# Altium project CAMERON.PrjPcb
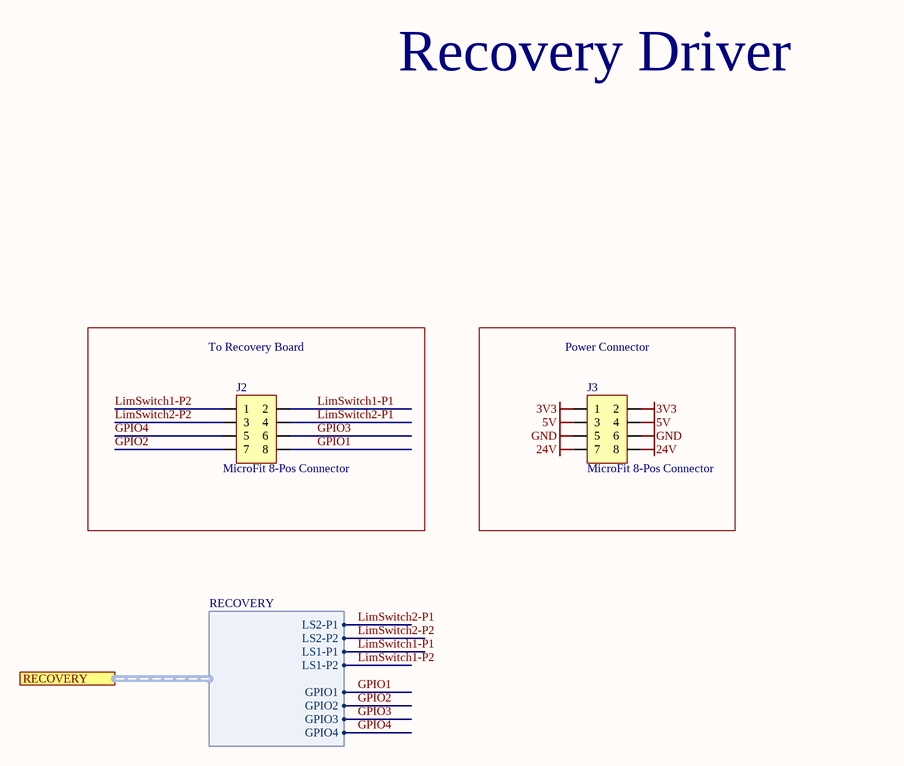
[diagram p0: Recovery.SchDoc]
13 sheets, 125 parts. Net scope: hierarchical (ports join the sheet entries above them; power ports are global).
Board file: CAMERON.PcbDoc
Sheets:
  Recovery.SchDoc
  CAMERON.SchDoc
    RIO_MCU = RIO_MCU.SchDoc
    Debugging/Programming = SWD_Breakout.SchDoc
    Power = Power.SchDoc
    Thermocouples = Thermocouples.SchDoc
      Thermocouple_Amplifier1 = Thermocouple_Amplifier.SchDoc
      Thermocouple_Amplifier2 = Thermocouple_Amplifier.SchDoc
      Thermocouple_Amplifier3 = Thermocouple_Amplifier.SchDoc
      Thermocouple_Amplifier4 = Thermocouple_Amplifier.SchDoc
    Solenoids = Solenoids.SchDoc
      Solenoid Driver1 = Solenoid_Driver.SchDoc
      Solenoid Driver2 = Solenoid_Driver.SchDoc
      Solenoid Driver3 = Solenoid_Driver.SchDoc
      Solenoid Driver4 = Solenoid_Driver.SchDoc
      Solenoid Driver5 = Solenoid_Driver.SchDoc
    Pressure Transducers = Pressure_Transducers.SchDoc
    Flight Computer = Flight_Computer.SchDoc
    XBee Radio = XBee.SchDoc
    Power_Monitor = Power_Monitor.SchDoc

## Sheet Recovery.SchDoc
size Letter; Organization: Altium Limited; Address1: L3, 12a Rodborough Rd; Address2: Frenchs Forest; Address3: NSW; Address4: Australia 2086

### Parts
(Parts that share a designator on the sheet are numbered #1, #2 ... from top to bottom, then left to right.)
J2#1  MicroFit 8-Pos Connector  [Microfit-8Pos]
J3#1  MicroFit 8-Pos Connector  [Microfit-8Pos]

### Blocks framed on the sheet
To Recovery Board: J2#1
Power Connector: J3#1

### Ports
RECOVERY (harness RECOVERY)

### Harnesses
RECOVERY: LS2-P1, LS2-P2, LS1-P1, LS1-P2, GPIO1, GPIO2, GPIO3, GPIO4

### Nets
3V3: J3#1.1 J3#1.2
5V: J3#1.3 J3#1.4
24V: J3#1.7 J3#1.8
GND: J3#1.5 J3#1.6
GPIO1: J2#1.8 ; port RECOVERY.GPIO1
GPIO2: J2#1.7 ; port RECOVERY.GPIO2
GPIO3: J2#1.6 ; port RECOVERY.GPIO3
GPIO4: J2#1.5 ; port RECOVERY.GPIO4
LimSwitch1-P1: J2#1.2 ; port RECOVERY.LS1-P1
LimSwitch1-P2: J2#1.1 ; port RECOVERY.LS1-P2
LimSwitch2-P1: J2#1.4 ; port RECOVERY.LS2-P1
LimSwitch2-P2: J2#1.3 ; port RECOVERY.LS2-P2

### Notes on the sheet
- Recovery Driver
- Title
- Size:
- Date:
- Letter
- Number:
- Time:
- Revision:
- Sheet
- of
- File:

### Library data of the parts
J2#1 J3#1 = Micro-Fit 8Pos: Molex MicroFit 8-Pos Connector; URL: https://www.digikey.com/products/en?WT.z_cid=sp_900_0310_buynow&keywords=430450813; DigiKey PN: WM2651-ND

## Sheet CAMERON.SchDoc
size Letter; Organization: Altium Limited; Address1: L3, 12a Rodborough Rd; Address2: Frenchs Forest; Address3: NSW; Address4: Australia 2086
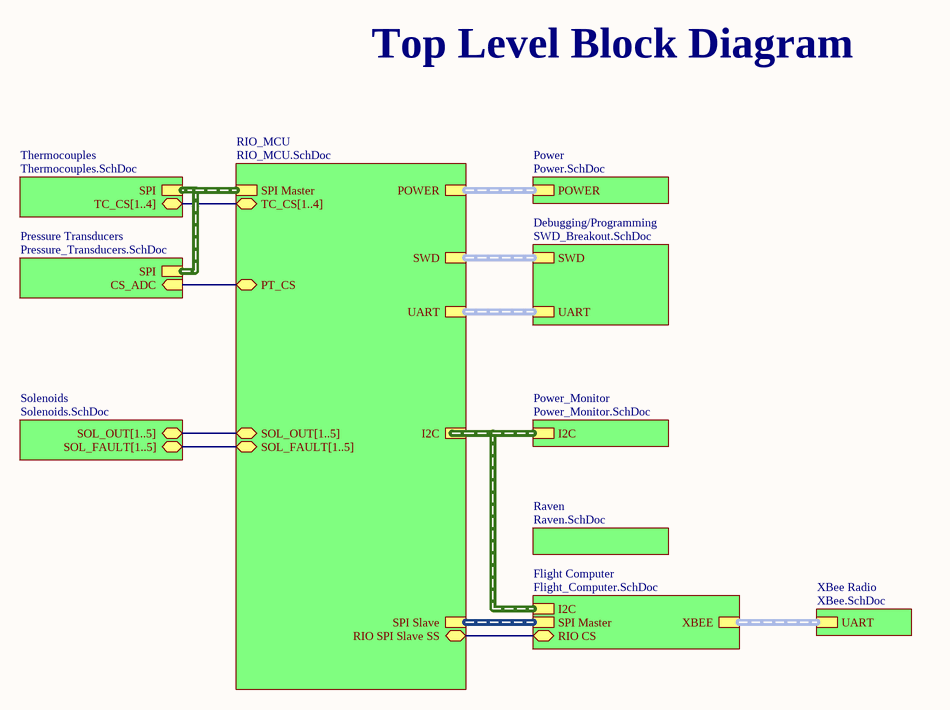
[diagram p1: CAMERON.SchDoc]

### Sub-sheets
Debugging/Programming = SWD_Breakout.SchDoc: SWD (harness SWD), UART (harness UART)
Flight Computer = Flight_Computer.SchDoc: SPI Master (harness SPI), RIO CS (bidir), XBEE (harness UART), I2C (harness I2C)
Power = Power.SchDoc: POWER (harness POWER)
Power_Monitor = Power_Monitor.SchDoc: I2C (harness I2C)
Pressure Transducers = Pressure_Transducers.SchDoc: SPI (harness SPI), CS_ADC (in)
Raven = Raven.SchDoc (file not in this document): no entries
RIO_MCU = RIO_MCU.SchDoc: I2C (harness I2C), SPI Master (harness SPI), SWD (harness SWD), POWER (harness POWER), TC_CS[1..4] (bidir), SPI Slave (harness SPI), RIO SPI Slave SS (bidir), SOL_OUT[1..5] (bidir), SOL_FAULT[1..5] (bidir), PT_CS (bidir), UART (harness UART)
Solenoids = Solenoids.SchDoc: SOL_OUT[1..5] (bidir), SOL_FAULT[1..5] (bidir)
Thermocouples = Thermocouples.SchDoc: SPI (harness SPI), TC_CS[1..4] (bidir)
XBee Radio = XBee.SchDoc: UART (harness UART)

### Nets
PT_CS: sheet RIO_MCU/PT_CS, sheet Pressure Transducers/CS_ADC
NetU1_77: sheet RIO_MCU/RIO SPI Slave SS, sheet Flight Computer/RIO CS

### Buses and harness runs
bus sheet RIO_MCU/SOL_FAULT[1..5] = sheet Solenoids/SOL_FAULT[1..5]
bus sheet RIO_MCU/SOL_OUT[1..5] = sheet Solenoids/SOL_OUT[1..5]
bus sheet RIO_MCU/TC_CS[1..4] = sheet Thermocouples/TC_CS[1..4]
harness sheet Debugging/Programming/SWD = sheet RIO_MCU/SWD
harness sheet Debugging/Programming/UART = sheet RIO_MCU/UART
harness sheet Flight Computer/I2C = sheet Power_Monitor/I2C = sheet RIO_MCU/I2C
harness sheet Flight Computer/SPI Master = sheet RIO_MCU/SPI Slave
harness sheet Flight Computer/XBEE = sheet XBee Radio/UART
harness sheet Power/POWER = sheet RIO_MCU/POWER
harness sheet Pressure Transducers/SPI = sheet RIO_MCU/SPI Master = sheet Thermocouples/SPI

### Notes on the sheet
- Top Level Block Diagram
- Title
- Size:
- Date:
- Letter
- Number:
- Time:
- Revision:
- Sheet
- of
- File:

## Sheet RIO_MCU.SchDoc
size Letter; Organization: Altium Limited; Address1: L3, 12a Rodborough Rd; Address2: Frenchs Forest; Address3: NSW; Address4: Australia 2086
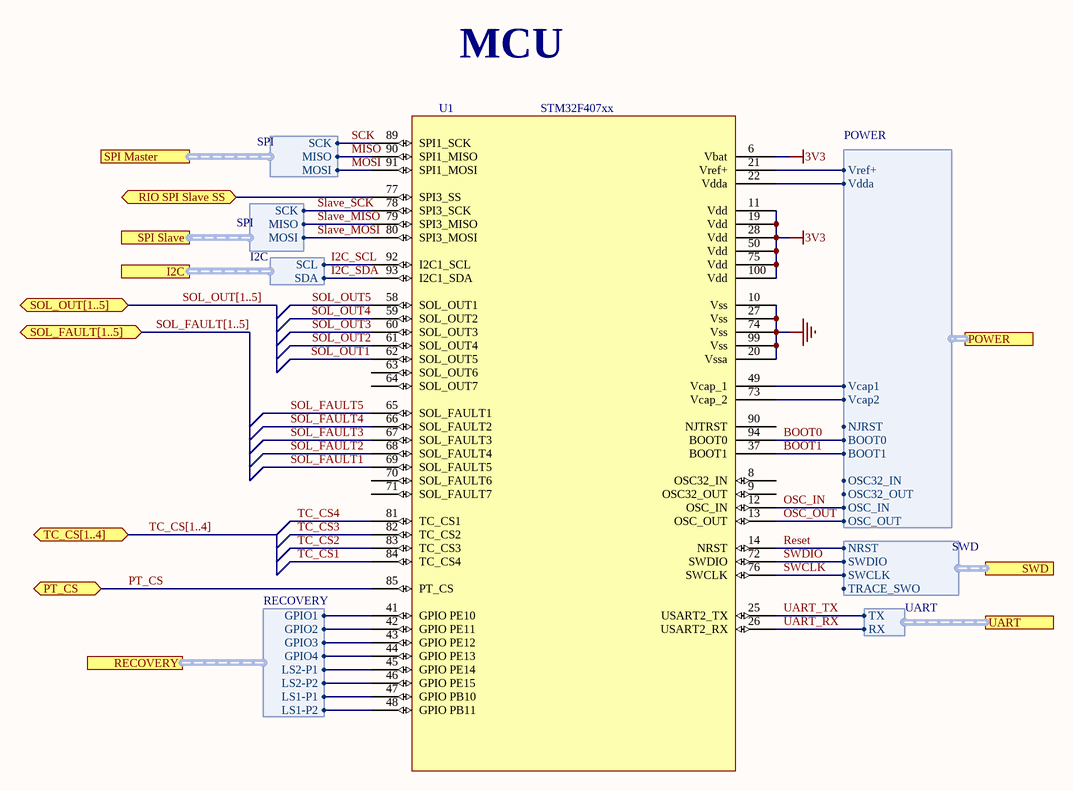
[diagram p2: RIO_MCU.SchDoc]

### Parts
U1  STM32F407xx  [LQFP100]

### Ports
I2C (harness I2C), POWER (harness POWER), PT_CS (bidir), RECOVERY (harness RECOVERY), RIO SPI Slave SS (bidir), SOL_FAULT[1..5] (bidir), SOL_OUT[1..5] (bidir), SPI Master (harness SPI), SPI Slave (harness SPI), SWD (harness SWD), TC_CS[1..4] (bidir), UART (harness UART)

### Harnesses
I2C: SCL, SDA
SWD: NRST, SWDIO, SWCLK, TRACE_SWO
POWER: Vdda, Vref+, Vcap1, Vcap2, NJRST, BOOT0, BOOT1, OSC32_IN, OSC32_OUT, OSC_IN, OSC_OUT
SPI: SCK, MISO, MOSI
SPI: MISO, MOSI, SCK
UART: RX, TX
RECOVERY: GPIO1, GPIO2, GPIO3, GPIO4, LS1-P1, LS1-P2, LS2-P1, LS2-P2

### Nets
3V3: U1.6(Vbat) U1.11(Vdd) U1.19(Vdd) U1.28(Vdd) U1.50(Vdd) U1.75(Vdd) U1.100(Vdd)
GND: U1.10(Vss) U1.20(Vssa) U1.27(Vss) U1.74(Vss) U1.99(Vss)
BOOT0: U1.94(BOOT0) ; port POWER.BOOT0
BOOT1: U1.37(BOOT1) ; port POWER.BOOT1
I2C_SCL: U1.92(I2C1_SCL) ; port I2C.SCL
I2C_SDA: U1.93(I2C1_SDA) ; port I2C.SDA
MISO: U1.90(NJTRST) ; port SPI Master.MISO
MOSI: U1.91(SPI1_MOSI) ; port SPI Master.MOSI
OSC_IN: U1.12(OSC_IN) ; port POWER.OSC_IN
OSC_OUT: U1.13(OSC_OUT) ; port POWER.OSC_OUT
PT_CS: U1.85(PT_CS) ; port PT_CS
Reset: U1.14(NRST) ; port SWD.NRST
SCK: U1.89(SPI1_SCK) ; port SPI Master.SCK
Slave_MISO: U1.79(SPI3_MISO) ; port SPI Slave.MISO
Slave_MOSI: U1.80(SPI3_MOSI) ; port SPI Slave.MOSI
Slave_SCK: U1.78(SPI3_SCK) ; port SPI Slave.SCK
SOL_FAULT1: U1.69(SOL_FAULT5)  [project net FAULT]
SOL_FAULT2: U1.68(SOL_FAULT4)  [project net FAULT]
SOL_FAULT3: U1.67(SOL_FAULT3)  [project net FAULT]
SOL_FAULT4: U1.66(SOL_FAULT2)  [project net FAULT]
SOL_FAULT5: U1.65(SOL_FAULT1)  [project net FAULT]
SOL_OUT1: U1.62(SOL_OUT5)  [project net SOL]
SOL_OUT2: U1.61(SOL_OUT4)  [project net SOL]
SOL_OUT3: U1.60(SOL_OUT3)  [project net SOL]
SOL_OUT4: U1.59(SOL_OUT2)  [project net SOL]
SOL_OUT5: U1.58(SOL_OUT1)  [project net SOL]
SWCLK: U1.76(SWCLK) ; port SWD.SWCLK
SWDIO: U1.72(SWDIO) ; port SWD.SWDIO
TC_CS1: U1.84(TC_CS4)  [project net CS]
TC_CS2: U1.83(TC_CS3)  [project net CS]
TC_CS3: U1.82(TC_CS2)  [project net CS]
TC_CS4: U1.81(TC_CS1)  [project net CS]
UART_RX: U1.26(USART2_RX) ; port UART.RX
UART_TX: U1.25(USART2_TX) ; port UART.TX
NetC10_2: U1.49(Vcap_1) ; port POWER.Vcap1
NetC11_2: U1.73(Vcap_2) ; port POWER.Vcap2
NetC12_2: U1.22(Vdda) ; port POWER.Vdda
NetC14_1: U1.21(Vref+) ; port POWER.Vref+
NetU1_41: U1.41(GPIO_PE10) ; port RECOVERY.GPIO1
NetU1_42: U1.42(GPIO_PE11) ; port RECOVERY.GPIO2
NetU1_43: U1.43(GPIO_PE12) ; port RECOVERY.GPIO3
NetU1_44: U1.44(GPIO_PE13) ; port RECOVERY.GPIO4
NetU1_45: U1.45(GPIO_PE14) ; port RECOVERY.LS2-P1
NetU1_46: U1.46(GPIO_PE15) ; port RECOVERY.LS2-P2
NetU1_47: U1.47(GPIO_PB10) ; port RECOVERY.LS1-P1
NetU1_48: U1.48(GPIO_PB11) ; port RECOVERY.LS1-P2
NetU1_77: U1.77(SPI3_SS) ; port RIO SPI Slave SS

Not connected (* = marked no-connect by the designer): U1 8(OSC32_IN) 9(OSC32_OUT) 63(SOL_OUT6) 64(SOL_OUT7) 70(SOL_FAULT6) 71(SOL_FAULT7)

### Buses and harness runs
bus SOL_FAULT[1..5] = port SOL_FAULT[1..5]
bus SOL_OUT[1..5] = port SOL_OUT[1..5]
bus TC_CS[1..4] = port TC_CS[1..4]

### Notes on the sheet
- MCU
- Title
- Size:
- Date:
- Letter
- Number:
- Time:
- Revision:
- Sheet
- of
- File:

## Sheet SWD_Breakout.SchDoc
size Letter; Organization: Altium Limited; Address1: L3, 12a Rodborough Rd; Address2: Frenchs Forest; Address3: NSW; Address4: Australia 2086
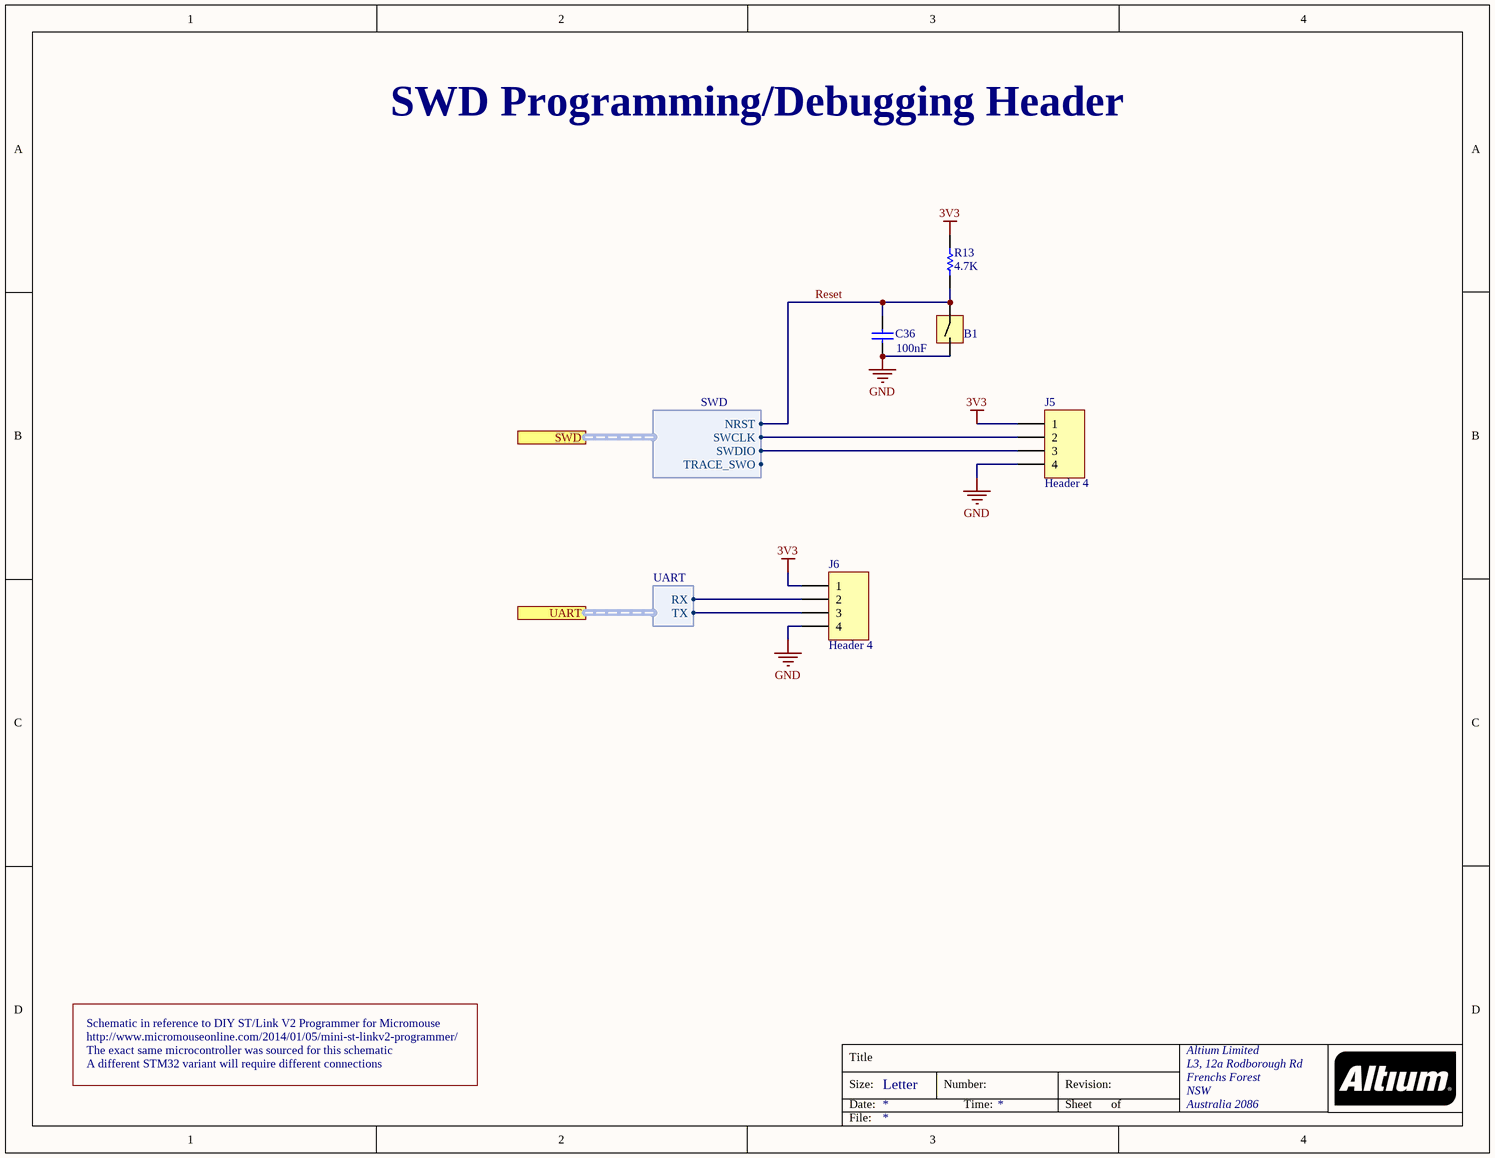
[diagram p3: SWD_Breakout.SchDoc]

### Parts
B1  Push Button  [PUSHBUTTON]  (value not drawn)
C36  value 100nF  [CAP_0603]  (hidden comment: Cap)
J5  Header 4  [HDR1X4]
J6  Header 4  [HDR1X4]
R13  value 4.7K  [RES_0603]  (hidden comment: Res1)

### Ports
SWD (harness SWD), UART (harness UART)

### Harnesses
SWD: NRST, SWCLK, SWDIO, TRACE_SWO
UART: RX, TX

### Nets
3V3: J5.1 J6.1 R13.2
GND: B1.2 C36.1 J5.4 J6.4
Reset: B1.1 C36.2 R13.1 ; port SWD.NRST
SWCLK: J5.2 ; port SWD.SWCLK
SWDIO: J5.3 ; port SWD.SWDIO
UART_RX: J6.2 ; port UART.RX
UART_TX: J6.3 ; port UART.TX

### Notes on the sheet
- SWD Programming/Debugging Header
- http://www.micromouseonline.com/2014/01/05/mini-st-linkv2-programmer/
- Schematic in reference to DIY ST/Link V2 Programmer for Micromouse
- The exact same microcontroller was sourced for this schematic
- A different STM32 variant will require different connections
- Title
- Size:
- Date:
- Letter
- Number:
- Time:
- Revision:
- Sheet
- of
- File:

### Library data of the parts
B1 = PushButton
C36 = Cap: Capacitor
J5 J6 = Header 4: Header, 4-Pin; LatestRevisionDate: 17-Jul-2002; LatestRevisionNote: Re-released for DXP Platform.; Publisher: Altium Limited
R13 = Res1: Resistor

## Sheet Power.SchDoc
size Letter; Organization: Altium Limited; Address1: L3, 12a Rodborough Rd; Address2: Frenchs Forest; Address3: NSW; Address4: Australia 2086
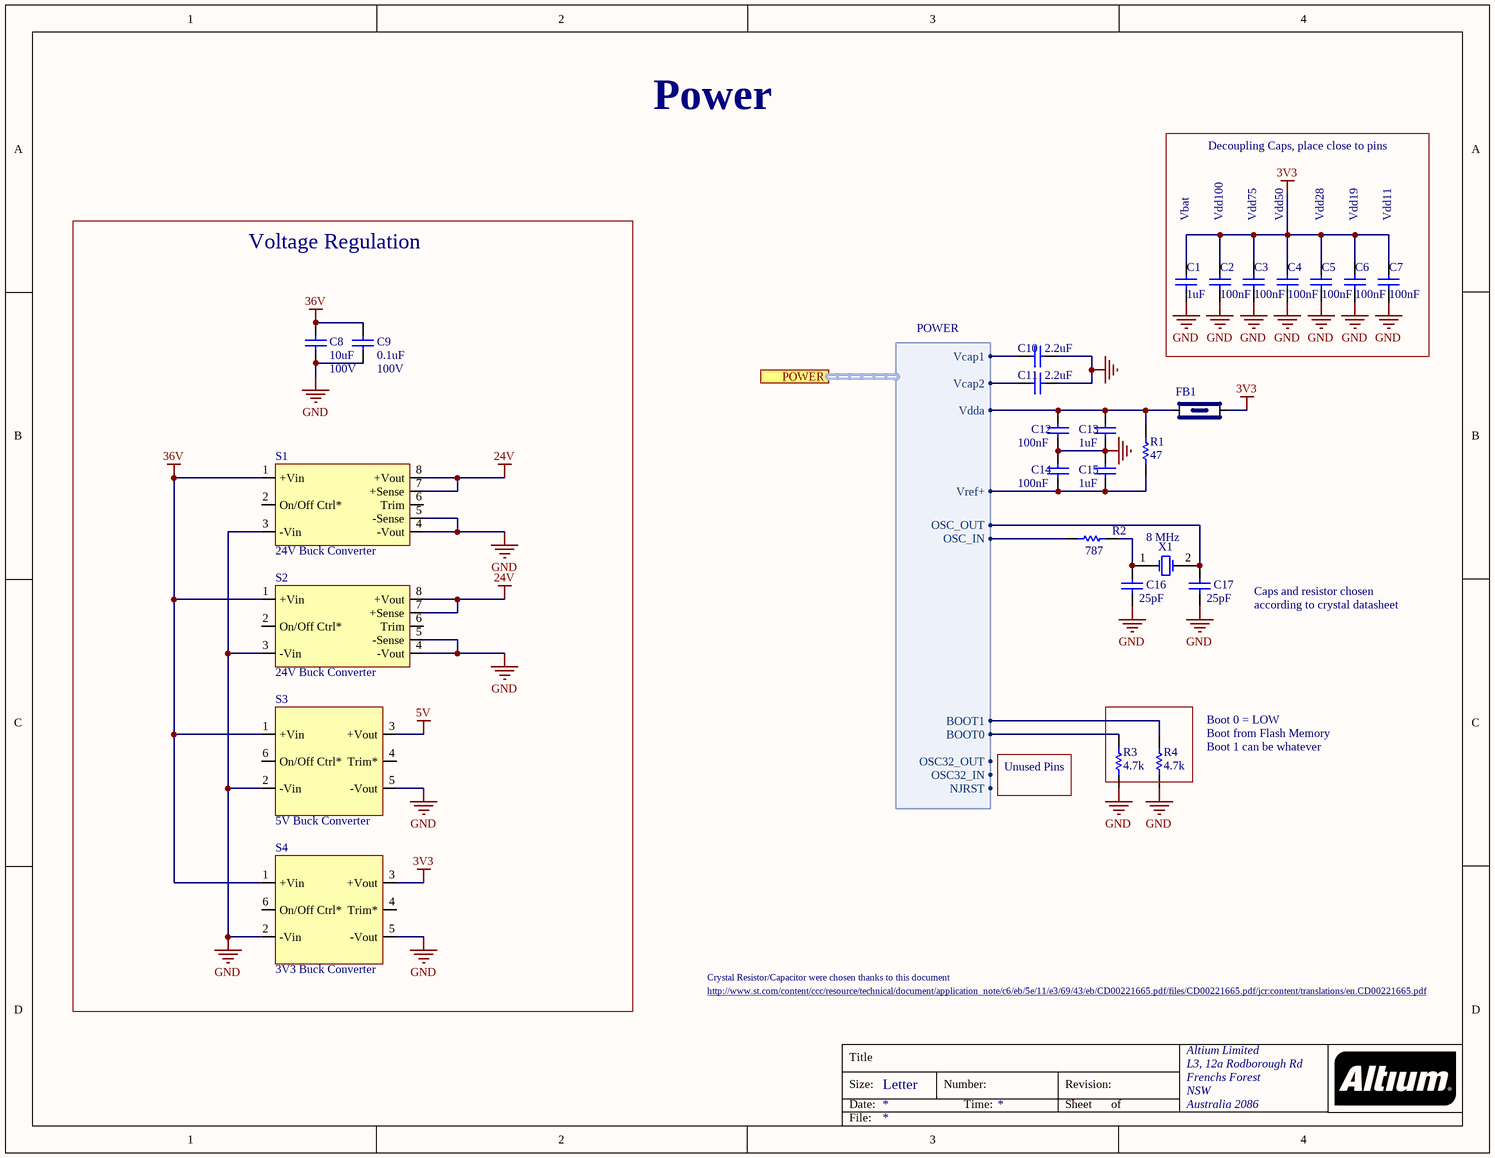
[diagram p4: Power.SchDoc]

### Parts
(Parts that share a designator on the sheet are numbered #1, #2 ... from top to bottom, then left to right.)
C1  value 1uF  [CAP_0603]
C2  value 100nF  [CAP_0603]
C3  value 100nF  [CAP_0603]
C4  value 100nF  [CAP_0603]
C5  value 100nF  [CAP_0603]
C6  value 100nF  [CAP_0603]
C7  value 100nF  [CAP_0603]
C8  value 10uF  Voltage: 100V  [2220]  (hidden comment: Cap)
C9  value 0.1uF  Voltage: 100V  [CAP_0603]  (hidden comment: Cap)
C10  value 2.2uF  [CAP_0603]
C11  value 2.2uF  [CAP_0603]
C12  value 100nF  [CAP_0603]
C13  value 1uF  [CAP_0603]
C14  value 100nF  [CAP_0603]
C15  value 1uF  [CAP_0603]
C16  value 25pF  [CAP_0603]
C17  value 25pF  [CAP_0603]
FB1  Ferrite Bead  [0603]  (value not drawn)
R1  value 47  [RES_0603]  (hidden comment: Res1)
R2#1  value 787  [RES_0603]  (hidden comment: Res1)
R3#1  value 4.7k  [RES_0603]  (hidden comment: Res1)
R4#1  value 4.7k  [RES_0603]  (hidden comment: Res1)
S1  24V Buck Converter  [UWE-24/3-Q12]
S2  24V Buck Converter  [UWE-24/3-Q12]
S3  5V Buck Converter  [SPM15-050-Q12P-C]
S4  3V3 Buck Converter  [SPM15-033-Q48N-C]
X1  Frequency: 8 MHz  [OSC_8MHz]  (hidden comment: XTAL)

### Blocks framed on the sheet
Voltage Regulation: C8 C9 S1-S4

### Ports
POWER (harness POWER)

### Harnesses
POWER: BOOT0, BOOT1, NJRST, OSC_IN, OSC_OUT, OSC32_IN, OSC32_OUT, Vcap1, Vcap2, Vdda, Vref+

### Nets
3V3: C1.2 C2.2 C3.2 C4.2 C5.2 C6.2 C7.2 FB1.2 S4.3(+Vout)
5V: S3.3(+Vout)
24V: S1.7(+Sense) S1.8(+Vout) S2.7(+Sense) S2.8(+Vout)
36V: C8.2 C9.2 S1.1(+Vin) S2.1(+Vin) S3.1(+Vin) S4.1(+Vin)
GND: C1.1 C2.1 C3.1 C4.1 C5.1 C6.1 C7.1 C8.1 C9.1 C10.1 C11.1 C12.1 C13.1 C14.2 C15.2 C16.1 C17.1 R3#1.1 R4#1.1 S1.3(-Vin) S1.4(-Vout) S1.5(-Sense) S2.3(-Vin) S2.4(-Vout) S2.5(-Sense) S3.2(-Vin) S3.5(-Vout) S4.2(-Vin) S4.5(-Vout)
BOOT0: R3#1.2 ; port POWER.BOOT0
BOOT1: R4#1.2 ; port POWER.BOOT1
OSC_IN: R2#1.2 ; port POWER.OSC_IN
OSC_OUT: C17.2 X1.2(OSC2) ; port POWER.OSC_OUT
NetC10_2: C10.2 ; port POWER.Vcap1
NetC11_2: C11.2 ; port POWER.Vcap2
NetC12_2: C12.2 C13.2 FB1.1 R1.2 ; port POWER.Vdda
NetC14_1: C14.1 C15.1 R1.1 ; port POWER.Vref+
NetC16_2: C16.2 R2#1.1 X1.1(OSC1)

Not connected (* = marked no-connect by the designer): S1 2(On/Off_Ctrl*) 6(Trim); S2 2(On/Off_Ctrl*) 6(Trim); S3 4(Trim*) 6(On/Off_Ctrl*); S4 4(Trim*) 6(On/Off_Ctrl*)

### Notes on the sheet
- Power
- Decoupling Caps, place close to pins
- Vbat
- Vdd100
- Vdd75
- Vdd50
- Vdd28
- Vdd19
- Vdd11
- Caps and resistor chosen
- according to crystal datasheet
- (near R3#1) Unused Pins
- (near R4#1) Boot 0 = LOW
- (near R4#1) Boot from Flash Memory
- (near R4#1) Boot 1 can be whatever
- http://www.st.com/content/ccc/resource/technical/document/application_note/c6/eb/5e/11/e3/69/43/eb/CD00221665.pdf/files/CD00221665.pdf/jcr:content/translations/en.CD00221665.pdf
- Crystal Resistor/Capacitor were chosen thanks to this document
- Title
- Size:
- Date:
- Letter
- Number:
- Time:
- Revision:
- Sheet
- of
- File:

### Library data of the parts
C1-C17 = Cap: Capacitor
  C8 C9: Published: 8-Jun-2000; LatestRevisionDate: 17-Jul-2002; LatestRevisionNote: Re-released for DXP Platform.; PackageReference: RAD-0.3; Publisher: Altium Limited; PackageDescription: Radial Cap, Thru-Hole; 2 Leads; 0.3 in Pin Spacing
R1 R2#1 R3#1 R4#1 = Res1: Resistor
S1 S2 = UWE-24/3-Q12PB-C: CONV DC/DC 72W 24V 3A; Link: https://www.digikey.com/product-detail/en/murata-power-solutions-inc/UWE-24-3-Q12PB-C/811-2236-5-ND/2346086
S3 = SPM15-050-Q12P-C: DC/DC CONVERTER 5V 15W; Link: https://www.digikey.com/product-detail/en/murata-power-solutions-inc/SPM15-050-Q12P-C/811-2909-5-ND/4693860
S4 = SPM15-033-Q12P-C: DC/DC CONVERTER 3.3V 15W; Link: https://www.digikey.com/product-detail/en/murata-power-solutions-inc/SPM15-033-Q12P-C/811-2907-5-ND/4693858
X1 = XTAL: Crystal Oscillator

## Sheet Thermocouples.SchDoc
size Letter; Organization: Altium Limited; Address1: L3, 12a Rodborough Rd; Address2: Frenchs Forest; Address3: NSW; Address4: Australia 2086
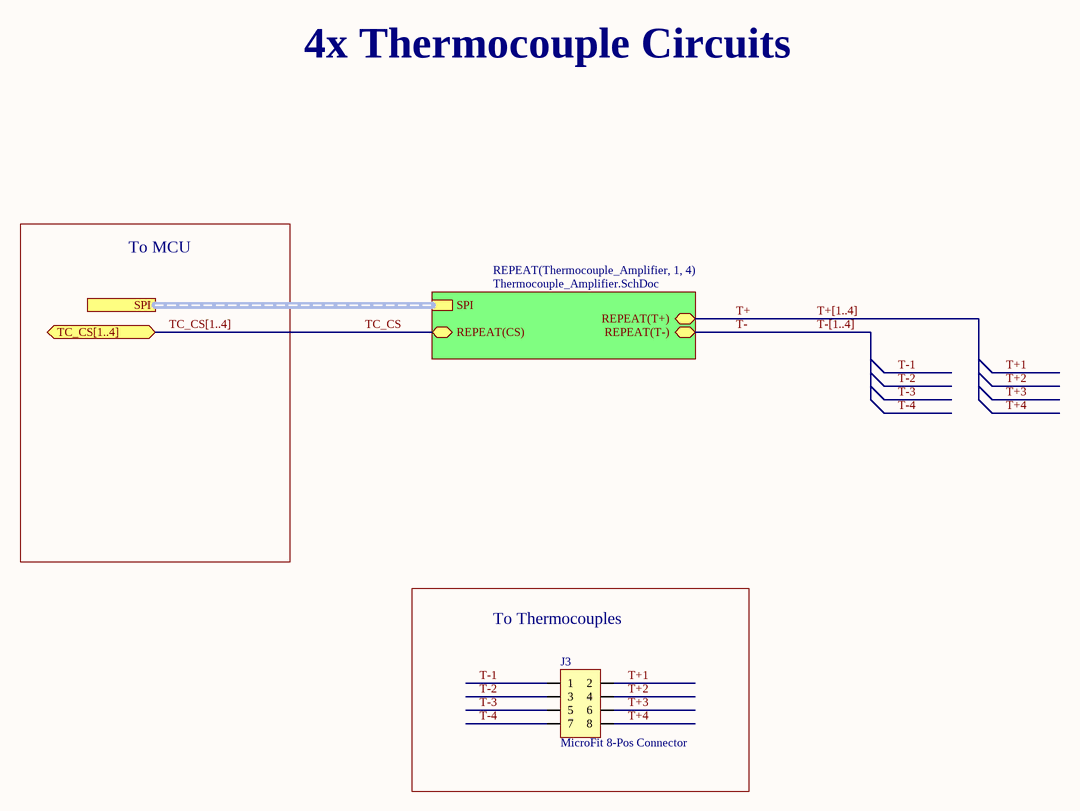
[diagram p5: Thermocouples.SchDoc]

### Parts
(Parts that share a designator on the sheet are numbered #1, #2 ... from top to bottom, then left to right.)
J3#2  MicroFit 8-Pos Connector  [Microfit-8Pos]

### Blocks framed on the sheet
To Thermocouples: J3#2

### Sub-sheets
REPEAT(Thermocouple_Amplifier, 1, 4) = Thermocouple_Amplifier.SchDoc: SPI (harness SPI), REPEAT(CS) (bidir), REPEAT(T+) (bidir), REPEAT(T-) (bidir)

### Ports
SPI (harness SPI), TC_CS[1..4] (bidir)

### Nets
T+: sheet REPEAT(Thermocouple_Amplifier, 1, 4)/REPEAT(T+)
T+1: J3#2.2  [project net T+]
T+2: J3#2.4  [project net T+]
T+3: J3#2.6  [project net T+]
T+4: J3#2.8  [project net T+]
T-: sheet REPEAT(Thermocouple_Amplifier, 1, 4)/REPEAT(T-)
T-1: J3#2.1  [project net T-]
T-2: J3#2.3  [project net T-]
T-3: J3#2.5  [project net T-]
T-4: J3#2.7  [project net T-]
TC_CS: sheet REPEAT(Thermocouple_Amplifier, 1, 4)/REPEAT(CS)

### Buses and harness runs
bus T+[1..4]
bus T-[1..4]
bus TC_CS[1..4] = port TC_CS[1..4]
harness port SPI = sheet REPEAT(Thermocouple_Amplifier, 1, 4)/SPI

### Notes on the sheet
- 4x Thermocouple Circuits
- To MCU
- Title
- Size:
- Date:
- Letter
- Number:
- Time:
- Revision:
- Sheet
- of
- File:

### Library data of the parts
J3#2 = Micro-Fit 8Pos: Molex MicroFit 8-Pos Connector; URL: https://www.digikey.com/products/en?WT.z_cid=sp_900_0310_buynow&keywords=430450813; DigiKey PN: WM2651-ND

## Sheet Thermocouple_Amplifier.SchDoc
size Letter; Organization: Altium Limited; Address1: L3, 12a Rodborough Rd; Address2: Frenchs Forest; Address3: NSW; Address4: Australia 2086
Used 4 times, as channels Thermocouples/Thermocouple_Amplifier1, Thermocouples/Thermocouple_Amplifier2, Thermocouples/Thermocouple_Amplifier3, Thermocouples/Thermocouple_Amplifier4. Parts and nets are listed once, with the designators drawn on the sheet.
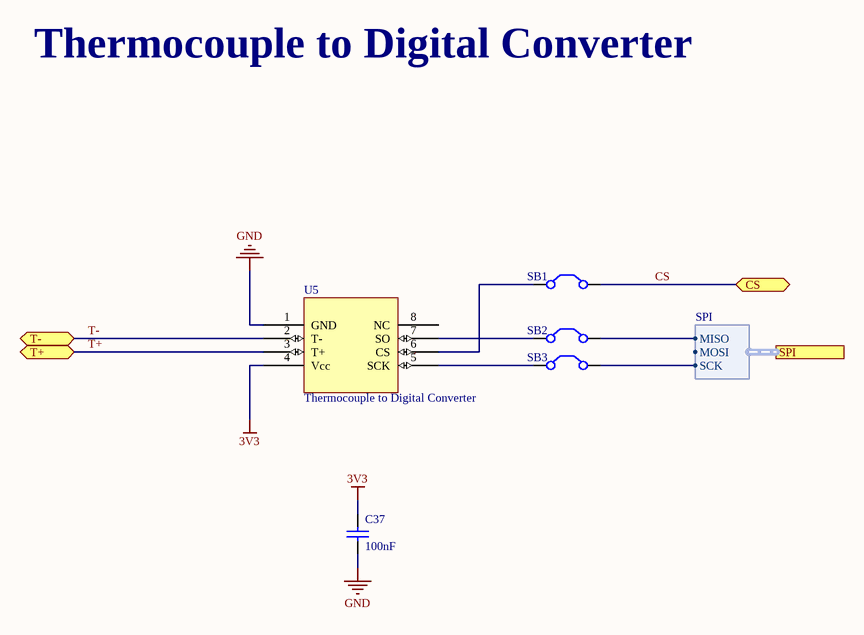
[diagram p6: Thermocouple_Amplifier.SchDoc]

### Parts
C37  value 100nF  [0603]  (hidden comment: Cap)
SB1  Solder Bridge  [Solder Bridge]  (value not drawn)
SB2  Solder Bridge  [Solder Bridge]  (value not drawn)
SB3  Solder Bridge  [Solder Bridge]  (value not drawn)
U5  Thermocouple to Digital Converter  [8-SOIC MAXIM]

### Ports
CS (bidir), SPI (harness SPI), T+ (bidir), T- (bidir)

### Harnesses
SPI: MISO, MOSI, SCK

### Nets
3V3: C37.2 U5.4(Vcc)
GND: C37.1 U5.1(GND)
CS: SB1.2(C2) ; port CS
T+: U5.3(T+) ; port T+
T-: U5.2(T-) ; port T-
NetSB1_1: SB1.1(C1) U5.6(CS)
NetSB2_1: SB2.1(C1) U5.7(SO)
NetSB2_2: SB2.2(C2) ; port SPI.MISO
NetSB3_1: SB3.1(C1) U5.5(SCK)
NetSB3_2: SB3.2(C2) ; port SPI.SCK

Not connected (* = marked no-connect by the designer): U5 8(NC)

### Channels
Thermocouples/Thermocouple_Amplifier1: designators end in _Thermocouple_Amplifier1; ports CS=CS T+=T+ T-=T-
Thermocouples/Thermocouple_Amplifier2: designators end in _Thermocouple_Amplifier2; ports CS=CS T+=T+ T-=T-
Thermocouples/Thermocouple_Amplifier3: designators end in _Thermocouple_Amplifier3; ports CS=CS T+=T+ T-=T-
Thermocouples/Thermocouple_Amplifier4: designators end in _Thermocouple_Amplifier4; ports CS=CS T+=T+ T-=T-

### Notes on the sheet
- Thermocouple to Digital Converter
- Title
- Size:
- Date:
- Letter
- Number:
- Time:
- Revision:
- Sheet
- of
- File:

### Library data of the parts
C37 = Cap: Capacitor
SB1-SB3 = Jumper: Jumper Wire
U5 = MAX31855x: Manufacturer PN: MAX31855EASA+; Thermocouple Type: E; DigiKey PN: MAX31855EASA+-ND

## Sheet Solenoids.SchDoc
size Letter; Organization: Altium Limited; Address1: L3, 12a Rodborough Rd; Address2: Frenchs Forest; Address3: NSW; Address4: Australia 2086
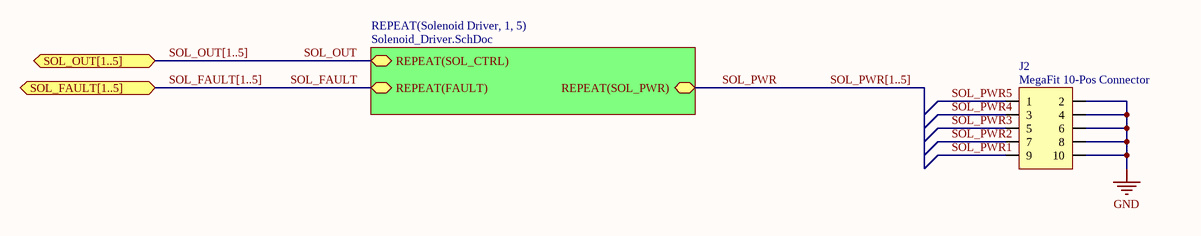
[diagram p7: Solenoids.SchDoc]

### Parts
(Parts that share a designator on the sheet are numbered #1, #2 ... from top to bottom, then left to right.)
J2#2  MegaFit 10-Pos Connector  [MegaFit-10Pos]

### Sub-sheets
REPEAT(Solenoid Driver, 1, 5) = Solenoid_Driver.SchDoc: REPEAT(FAULT) (bidir), REPEAT(SOL_CTRL) (bidir), REPEAT(SOL_PWR) (bidir)

### Ports
SOL_FAULT[1..5] (bidir), SOL_OUT[1..5] (bidir)

### Nets
GND: J2#2.2 J2#2.4 J2#2.6 J2#2.8 J2#2.10
SOL_FAULT: sheet REPEAT(Solenoid Driver, 1, 5)/REPEAT(FAULT)
SOL_OUT: sheet REPEAT(Solenoid Driver, 1, 5)/REPEAT(SOL_CTRL)
SOL_PWR: sheet REPEAT(Solenoid Driver, 1, 5)/REPEAT(SOL_PWR)
SOL_PWR1: J2#2.9
SOL_PWR2: J2#2.7
SOL_PWR3: J2#2.5
SOL_PWR4: J2#2.3
SOL_PWR5: J2#2.1

### Buses and harness runs
bus SOL_FAULT[1..5] = port SOL_FAULT[1..5]
bus SOL_OUT[1..5] = port SOL_OUT[1..5]
bus SOL_PWR[1..5]

### Notes on the sheet
- Title
- Size:
- Date:
- Letter
- Number:
- Time:
- Revision:
- Sheet
- of
- File:

### Library data of the parts
J2#2 = Mega-Fit 10Pos: Molex MegaFit 10-Pos Connector; URL: https://www.digikey.com/product-detail/en/molex-llc/0768290010/WM11979-ND/5639621; DigiKey PN: WM11979-ND

## Sheet Solenoid_Driver.SchDoc
size Letter; Organization: Altium Limited; Address1: L3, 12a Rodborough Rd; Address2: Frenchs Forest; Address3: NSW; Address4: Australia 2086
Used 5 times, as channels Solenoids/Solenoid Driver1, Solenoids/Solenoid Driver2, Solenoids/Solenoid Driver3, Solenoids/Solenoid Driver4, Solenoids/Solenoid Driver5. Parts and nets are listed once, with the designators drawn on the sheet.
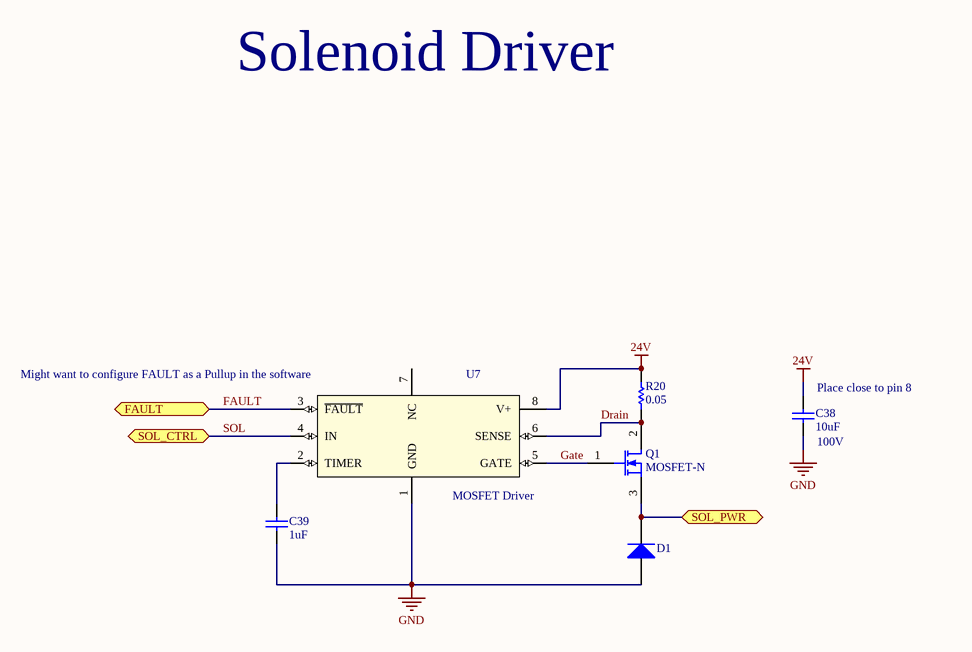
[diagram p8: Solenoid_Driver.SchDoc]

### Parts
C38  value 10uF  Voltage: 100V  [1206]  (hidden comment: Cap)
C39  value 1uF  [0603]  (hidden comment: Cap)
D1  Diode  [SMC]  (value not drawn)
Q1  MOSFET-N  [DPAK2]
R20  value 0.05  [0603]  (hidden comment: Res1)
U7  MOSFET Driver  [PSO-8]

### Ports
FAULT (bidir), SOL_CTRL (bidir), SOL_PWR (bidir)

### Nets
24V: C38.2 R20.2 U7.8(V+)
GND: C38.1 C39.1 D1.1(A) U7.1(GND)
Drain: Q1.2(D) R20.1 U7.6(SENSE)
FAULT: U7.3(~{FAULT}) ; port FAULT
Gate: Q1.1(G) U7.5(GATE)
SOL: U7.4(IN) ; port SOL_CTRL
SOL_PWR: D1.2(K) Q1.3(S) ; port SOL_PWR
NetC39_2: C39.2 U7.2(TIMER)

Not connected (* = marked no-connect by the designer): U7 7(NC)

### Channels
Solenoids/Solenoid Driver1: designators end in _SolenoidDriver1; ports FAULT=FAULT SOL_CTRL=SOL SOL_PWR=SOL_PWR1
Solenoids/Solenoid Driver2: designators end in _SolenoidDriver2; ports FAULT=FAULT SOL_CTRL=SOL SOL_PWR=SOL_PWR2
Solenoids/Solenoid Driver3: designators end in _SolenoidDriver3; ports FAULT=FAULT SOL_CTRL=SOL SOL_PWR=SOL_PWR3
Solenoids/Solenoid Driver4: designators end in _SolenoidDriver4; ports FAULT=FAULT SOL_CTRL=SOL SOL_PWR=SOL_PWR4
Solenoids/Solenoid Driver5: designators end in _SolenoidDriver5; ports FAULT=FAULT SOL_CTRL=SOL SOL_PWR=SOL_PWR5

### Notes on the sheet
- Solenoid Driver
- (near U7) Might want to configure FAULT as a Pullup in the software
- (near C38) Place close to pin 8
- Title
- Size:
- Date:
- Letter
- Number:
- Time:
- Revision:
- Sheet
- of
- File:

### Library data of the parts
C38 C39 = Cap: Capacitor
D1 = Diode: Default Diode
Q1 = MOSFET-N: N-Channel MOSFET; DigiKey PN: IRFZ34NSTRLPBFCT-ND; ComponentLink1Description: DigiKey URL; ComponentLink1URL: https://www.digikey.com/product-detail/en/infineon-technologies/IRFZ34NSTRLPBF/IRFZ34NSTRLPBFCT-ND/2441060
R20 = Res1: Resistor
U7 = LT1910ES8#PBF: Vendor: Linear Technology; Manufacturer_Part_Number: lt1910es8#pbf; Value: Value; Type: Type; RefDes: RefDes; DigiKey PN: LT1910ES8#TRPBFCT-ND

## Sheet Pressure_Transducers.SchDoc
size Letter; Organization: Altium Limited; Address1: L3, 12a Rodborough Rd; Address2: Frenchs Forest; Address3: NSW; Address4: Australia 2086
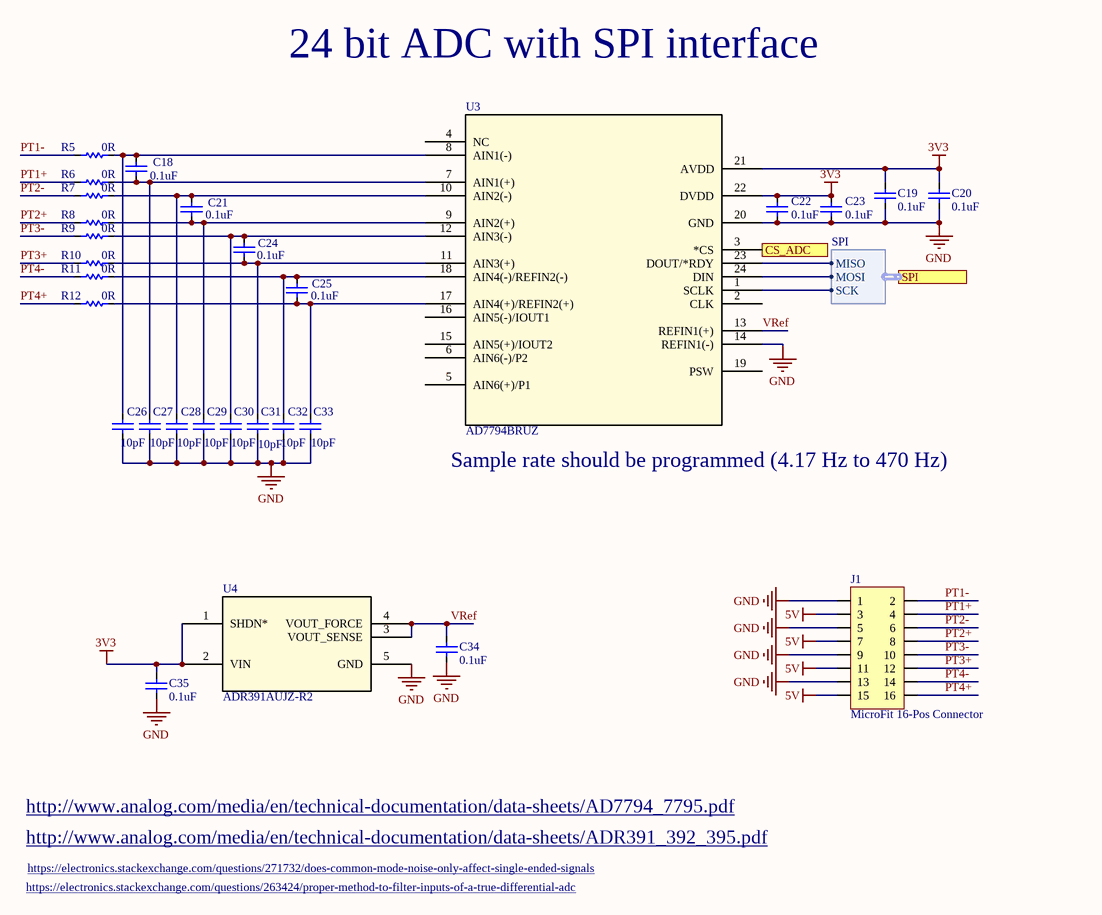
[diagram p9: Pressure_Transducers.SchDoc]

### Parts
C18  value 0.1uF  [0603]  (hidden comment: Cap)
C19  value 0.1uF  [0603]  (hidden comment: Cap)
C20  value 0.1uF  [0603]  (hidden comment: Cap)
C21  value 0.1uF  [0603]  (hidden comment: Cap)
C22  value 0.1uF  [0603]  (hidden comment: Cap)
C23  value 0.1uF  [0603]  (hidden comment: Cap)
C24  value 0.1uF  [0603]  (hidden comment: Cap)
C25  value 0.1uF  [0603]  (hidden comment: Cap)
C26  value 10pF  [0603]  (hidden comment: Cap)
C27  value 10pF  [0603]  (hidden comment: Cap)
C28  value 10pF  [0603]  (hidden comment: Cap)
C29  value 10pF  [0603]  (hidden comment: Cap)
C30  value 10pF  [0603]  (hidden comment: Cap)
C31  value 10pF  [0603]  (hidden comment: Cap)
C32  value 10pF  [0603]  (hidden comment: Cap)
C33  value 10pF  [0603]  (hidden comment: Cap)
C34  value 0.1uF  [0603]  (hidden comment: Cap)
C35  value 0.1uF  [0603]  (hidden comment: Cap)
J1  MicroFit 16-Pos Connector  [Microfit-16Pos]
R5  value 0R  [SB-2pos]  (hidden comment: Res)
R6  value 0R  [SB-2pos]  (hidden comment: Res)
R7  value 0R  [SB-2pos]  (hidden comment: Res)
R8  value 0R  [SB-2pos]  (hidden comment: Res)
R9  value 0R  [SB-2pos]  (hidden comment: Res)
R10  value 0R  [SB-2pos]  (hidden comment: Res)
R11  value 0R  [SB-2pos]  (hidden comment: Res)
R12  value 0R  [SB-2pos]  (hidden comment: Res)
U3  AD7794BRUZ  [RU_24]
U4  ADR391AUJZ-R2  [UJ_5]

### Ports
CS_ADC (in), SPI (harness SPI)

### Harnesses
SPI: MISO, MOSI, SCK

### Nets
3V3: C19.2 C20.2 C22.2 C23.2 C35.2 U3.21(AVDD) U3.22(DVDD) U4.1(SHDN*) U4.2(VIN)
5V: J1.3 J1.7 J1.11 J1.15
GND: C19.1 C20.1 C22.1 C23.1 C26.1 C27.1 C28.1 C29.1 C30.1 C31.1 C32.1 C33.1 C34.1 C35.1 J1.1 J1.5 J1.9 J1.13 U3.14(REFIN1(-)) U3.20(GND) U4.5(GND)
MISO: U3.23(DOUT/*RDY) ; port SPI.MISO
MOSI: U3.24(DIN) ; port SPI.MOSI
PT1+: J1.4 R6.1
PT1-: J1.2 R5.1
PT2+: J1.8 R8.1
PT2-: J1.6 R7.1
PT3+: J1.12 R10.1
PT3-: J1.10 R9.1
PT4+: J1.16 R12.1
PT4-: J1.14 R11.1
PT_CS: U3.3(*CS) ; port CS_ADC
SCK: U3.1(SCLK) ; port SPI.SCK
VRef: C34.2 U3.13(REFIN1(+)) U4.3(VOUT_SENSE) U4.4(VOUT_FORCE)
NetC18_1: C18.1 C27.2 R6.2 U3.7(AIN1(+))
NetC18_2: C18.2 C26.2 R5.2 U3.8(AIN1(-))
NetC21_1: C21.1 C29.2 R8.2 U3.9(AIN2(+))
NetC21_2: C21.2 C28.2 R7.2 U3.10(AIN2(-))
NetC24_1: C24.1 C31.2 R10.2 U3.11(AIN3(+))
NetC24_2: C24.2 C30.2 R9.2 U3.12(AIN3(-))
NetC25_1: C25.1 C33.2 R12.2 U3.17(AIN4(+)/REFIN2(+))
NetC25_2: C25.2 C32.2 R11.2 U3.18(AIN4(-)/REFIN2(-))

Not connected (* = marked no-connect by the designer): U3 2(CLK) 4(NC) 5(AIN6(+)/P1) 6(AIN6(-)/P2) 15(AIN5(+)/IOUT2) 16(AIN5(-)/IOUT1) 19(PSW)

### Notes on the sheet
- 24 bit ADC with SPI interface
- Sample rate should be programmed (4.17 Hz to 470 Hz)
- http://www.analog.com/media/en/technical-documentation/data-sheets/AD7794_7795.pdf
- http://www.analog.com/media/en/technical-documentation/data-sheets/ADR391_392_395.pdf
- https://electronics.stackexchange.com/questions/263424/proper-method-to-filter-inputs-of-a-true-differential-adc
- https://electronics.stackexchange.com/questions/271732/does-common-mode-noise-only-affect-single-ended-signals
- Title
- Size:
- Date:
- Letter
- Number:
- Time:
- Revision:
- Sheet
- of
- File:

### Library data of the parts
J1 = Micro-Fit 16Pos: Molex MicroFit 16-Pos Connector; URL: https://www.digikey.com/product-detail/en/molex-llc/0430451628/WM10719-ND/3310256; DigiKey PN: WM10719-ND
U3 = AD7794BRUZ: Imported; Value: Value; Type: Type; RefDes: RefDes
U4 = ADR391AUJZ-R2: Imported; Manufacturer_Part_Number: ADR391AUJZ-R2; Vendor: Vendor; Value: Value; Type: Type; RefDes: Refdes

## Sheet Flight_Computer.SchDoc
size Letter; Organization: Altium Limited; Address1: L3, 12a Rodborough Rd; Address2: Frenchs Forest; Address3: NSW; Address4: Australia 2086
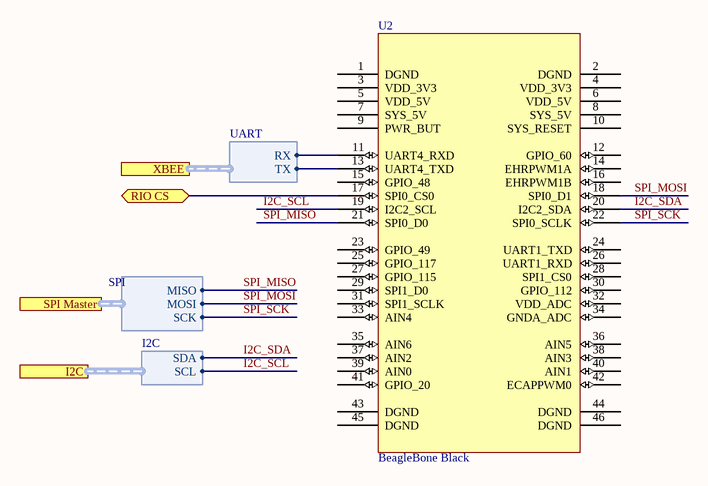
[diagram p10: Flight_Computer.SchDoc]

### Parts
U2  BeagleBone Black  [BeagleBoneBlack]

### Ports
I2C (harness I2C), RIO CS (bidir), SPI Master (harness SPI), XBEE (harness UART)

### Harnesses
SPI: MISO, MOSI, SCK
UART: TX, RX
I2C: SCL, SDA

### Nets
I2C_SCL: U2.19(I2C2_SCL) ; port I2C.SCL
I2C_SDA: U2.20(I2C2_SDA) ; port I2C.SDA
SPI_MISO: U2.21(SPI0_D0) ; port SPI Master.MISO  [project net Slave_MISO]
SPI_MOSI: U2.18(SPI0_D1) ; port SPI Master.MOSI  [project net Slave_MOSI]
SPI_SCK: U2.22(SPI0_SCLK) ; port SPI Master.SCK  [project net Slave_SCK]
NetU1_77: U2.17(SPI0_CS0) ; port RIO CS
NetU2_11: U2.11(UART4_RXD) ; port XBEE.RX
NetU2_13: U2.13(UART4_TXD) ; port XBEE.TX

Not connected (* = marked no-connect by the designer): U2 1(DGND) 2(DGND) 3(VDD_3V3) 4(VDD_3V3) 5(VDD_5V) 6(VDD_5V) 7(SYS_5V) 8(SYS_5V) 9(PWR_BUT) 10(SYS_RESET) 12(GPIO_60) 14(EHRPWM1A) 15(GPIO_48) 16(EHRPWM1B) 23(GPIO_49) 24(UART1_TXD) 25(GPIO_117) 26(UART1_RXD) 27(GPIO_115) 28(SPI1_CS0) 29(SPI1_D0) 30(GPIO_112) 31(SPI1_SCLK) 32(VDD_ADC) 33(AIN4) 34(GNDA_ADC) 35(AIN6) 36(AIN5) 37(AIN2) 38(AIN3) 39(AIN0) 40(AIN1) 41(GPIO_20) 42(ECAPPWM0) 43(DGND) 44(DGND) 45(DGND) 46(DGND)

### Notes on the sheet
- Title
- Size:
- Date:
- Letter
- Number:
- Time:
- Revision:
- Sheet
- of
- File:

### Library data of the parts
U2 = BeagleBone_Black: P9 Header of a BeagleBone Black

## Sheet XBee.SchDoc
size Letter; Organization: Altium Limited; Address1: L3, 12a Rodborough Rd; Address2: Frenchs Forest; Address3: NSW; Address4: Australia 2086
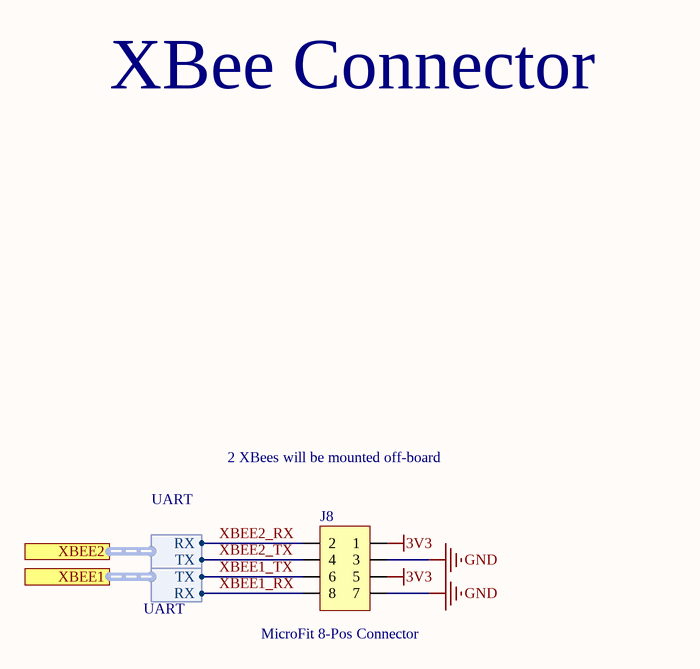
[diagram p11: XBee.SchDoc]

### Parts
J8  MicroFit 8-Pos Connector  [Microfit-8Pos]

### Ports
XBEE1 (harness UART), XBEE2 (harness UART)

### Harnesses
UART: RX, TX

### Nets
3V3: J8.1 J8.5
GND: J8.3 J8.7
XBEE1_RX: J8.8 ; port XBEE1.RX
XBEE1_TX: J8.6 ; port XBEE1.TX
XBEE2_RX: J8.2 ; port XBEE2.RX
XBEE2_TX: J8.4 ; port XBEE2.TX

### Notes on the sheet
- XBee Connector
- 2 XBees will be mounted off-board
- Title
- Size:
- Date:
- Letter
- Number:
- Time:
- Revision:
- Sheet
- of
- File:

### Library data of the parts
J8 = Micro-Fit 8Pos: Molex MicroFit 8-Pos Connector; URL: https://www.digikey.com/products/en?WT.z_cid=sp_900_0310_buynow&keywords=430450813; DigiKey PN: WM2651-ND

## Sheet Power_Monitor.SchDoc: Battery and Charger Breakouts
size A; Date: Dec 27, 2017; DrawnBy: Seyed Omid Hasanli; Revision: 1.0; SheetNumber: 12
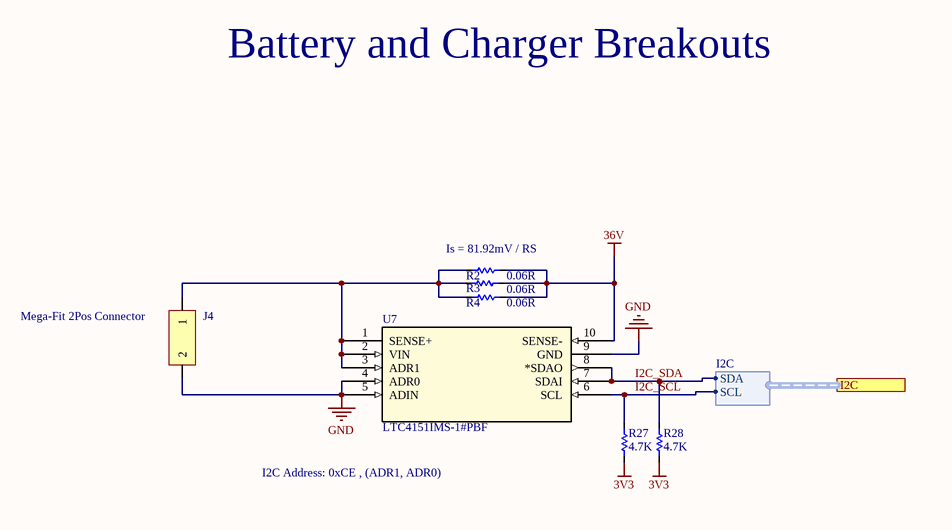
[diagram p12: Power_Monitor.SchDoc]

### Parts
(Parts that share a designator on the sheet are numbered #1, #2 ... from top to bottom, then left to right.)
J4  Mega-Fit 2Pos Connector  [MegaFit-2Pos]
R2#2  value 0.06R  [0402]  (hidden comment: Res)
R3#2  value 0.06R  [0402]  (hidden comment: Res)
R4#2  value 0.06R  [0402]  (hidden comment: Res)
R27  value 4.7K  [0603]  (hidden comment: Res)
R28  value 4.7K  [0603]  (hidden comment: Res)
U7  LTC4151IMS-1#PBF  [MSOP-10_MS]

### Ports
I2C (harness I2C)

### Harnesses
I2C: SCL, SDA

### Nets
3V3: R27.1 R28.1
36V: R2#2.2 R3#2.2 R4#2.2 U7.10(SENSE-)
GND: J4.2 U7.4(ADR0) U7.5(ADIN) U7.9(GND)
I2C_SCL: R27.2 U7.6(SCL) ; port I2C.SCL
I2C_SDA: R28.2 U7.7(SDAI) U7.8(*SDAO) ; port I2C.SDA
NetJ4_1: J4.1 R2#2.1 R3#2.1 R4#2.1 U7.1(SENSE+) U7.2(VIN) U7.3(ADR1)

### Notes on the sheet
- Battery and Charger Breakouts
- (near R2#2) Is = 81.92mV / RS
- I2C Address: 0xCE , (ADR1, ADR0)
- Title:
- DrawnBy:
- Revision:
- SheetNumber:
- Date:
- Datasheet Link:

### Library data of the parts
J4 = Mega-Fit 2Pos: Molex MegaFit 2-Pos Connector; URL: https://www.digikey.com/product-detail/en/molex-llc/0768290010/WM11979-ND/5639621; DigiKey PN: WM11979-ND
U7 = LTC4151IMS-1#PBF: Imported; Vendor: Linear Technology; C: Copyright (C) 2016 Accelerated Designs. All rights reserved; Manufacturer_Part_Number: ltc4151ims-1#pbf; Copyright: Copyright (C) 2016 Accelerated Designs. All rights reserved; Value: Value; Type: Type; RefDes: RefDes

## Nets that join several sheets
3V3: Recovery (J3#1.1 J3#1.2), RIO_MCU (7 pins), SWD_Breakout (J5.1 J6.1 R13.2), Power (9 pins), Thermocouples/Thermocouple_Amplifier1 (C37_Thermocouple_Amplifier1.2 U5_Thermocouple_Amplifier1.4), Thermocouples/Thermocouple_Amplifier2 (C37_Thermocouple_Amplifier2.2 U5_Thermocouple_Amplifier2.4), Thermocouples/Thermocouple_Amplifier3 (C37_Thermocouple_Amplifier3.2 U5_Thermocouple_Amplifier3.4), Thermocouples/Thermocouple_Amplifier4 (C37_Thermocouple_Amplifier4.2 U5_Thermocouple_Amplifier4.4), Pressure_Transducers (9 pins), XBee (J8.1 J8.5), Power_Monitor (R27.1 R28.1)
5V: Recovery (J3#1.3 J3#1.4), Power (S3.3), Pressure_Transducers (J1.3 J1.7 J1.11 J1.15)
24V: Recovery (J3#1.7 J3#1.8), Power (S1.7 S1.8 S2.7 S2.8), Solenoids/Solenoid Driver1 (C38_SolenoidDriver1.2 R20_SolenoidDriver1.2 U7_SolenoidDriver1.8), Solenoids/Solenoid Driver2 (C38_SolenoidDriver2.2 R20_SolenoidDriver2.2 U7_SolenoidDriver2.8), Solenoids/Solenoid Driver3 (C38_SolenoidDriver3.2 R20_SolenoidDriver3.2 U7_SolenoidDriver3.8), Solenoids/Solenoid Driver4 (C38_SolenoidDriver4.2 R20_SolenoidDriver4.2 U7_SolenoidDriver4.8), Solenoids/Solenoid Driver5 (C38_SolenoidDriver5.2 R20_SolenoidDriver5.2 U7_SolenoidDriver5.8)
36V: Power (6 pins), Power_Monitor (R2#2.2 R3#2.2 R4#2.2 U7.10)
GND: Recovery (J3#1.5 J3#1.6), RIO_MCU (5 pins), SWD_Breakout (B1.2 C36.1 J5.4 J6.4), Power (29 pins), Thermocouples/Thermocouple_Amplifier1 (C37_Thermocouple_Amplifier1.1 U5_Thermocouple_Amplifier1.1), Thermocouples/Thermocouple_Amplifier2 (C37_Thermocouple_Amplifier2.1 U5_Thermocouple_Amplifier2.1), Thermocouples/Thermocouple_Amplifier3 (C37_Thermocouple_Amplifier3.1 U5_Thermocouple_Amplifier3.1), Thermocouples/Thermocouple_Amplifier4 (C37_Thermocouple_Amplifier4.1 U5_Thermocouple_Amplifier4.1), Solenoids (5 pins), Solenoids/Solenoid Driver1 (C38_SolenoidDriver1.1 C39_SolenoidDriver1.1 D1_SolenoidDriver1.1 U7_SolenoidDriver1.1), Solenoids/Solenoid Driver2 (C38_SolenoidDriver2.1 C39_SolenoidDriver2.1 D1_SolenoidDriver2.1 U7_SolenoidDriver2.1), Solenoids/Solenoid Driver3 (C38_SolenoidDriver3.1 C39_SolenoidDriver3.1 D1_SolenoidDriver3.1 U7_SolenoidDriver3.1), Solenoids/Solenoid Driver4 (C38_SolenoidDriver4.1 C39_SolenoidDriver4.1 D1_SolenoidDriver4.1 U7_SolenoidDriver4.1), Solenoids/Solenoid Driver5 (C38_SolenoidDriver5.1 C39_SolenoidDriver5.1 D1_SolenoidDriver5.1 U7_SolenoidDriver5.1), Pressure_Transducers (21 pins), XBee (J8.3 J8.7), Power_Monitor (J4.2 U7.4 U7.5 U7.9)
BOOT0: RIO_MCU (U1.94), Power (R3#1.2)
BOOT1: RIO_MCU (U1.37), Power (R4#1.2)
CS: RIO_MCU (U1.81), Thermocouples/Thermocouple_Amplifier4 (SB1_Thermocouple_Amplifier4.2)
CS: RIO_MCU (U1.82), Thermocouples/Thermocouple_Amplifier3 (SB1_Thermocouple_Amplifier3.2)
CS: RIO_MCU (U1.83), Thermocouples/Thermocouple_Amplifier2 (SB1_Thermocouple_Amplifier2.2)
CS: RIO_MCU (U1.84), Thermocouples/Thermocouple_Amplifier1 (SB1_Thermocouple_Amplifier1.2)
FAULT: RIO_MCU (U1.65), Solenoids/Solenoid Driver5 (U7_SolenoidDriver5.3)
FAULT: RIO_MCU (U1.66), Solenoids/Solenoid Driver4 (U7_SolenoidDriver4.3)
FAULT: RIO_MCU (U1.67), Solenoids/Solenoid Driver3 (U7_SolenoidDriver3.3)
FAULT: RIO_MCU (U1.68), Solenoids/Solenoid Driver2 (U7_SolenoidDriver2.3)
FAULT: RIO_MCU (U1.69), Solenoids/Solenoid Driver1 (U7_SolenoidDriver1.3)
I2C_SCL: RIO_MCU (U1.92), Flight_Computer (U2.19), Power_Monitor (R27.2 U7.6)
I2C_SDA: RIO_MCU (U1.93), Flight_Computer (U2.20), Power_Monitor (R28.2 U7.7 U7.8)
MISO: RIO_MCU (U1.90), Thermocouples/Thermocouple_Amplifier1 (SB2_Thermocouple_Amplifier1.2), Thermocouples/Thermocouple_Amplifier2 (SB2_Thermocouple_Amplifier2.2), Thermocouples/Thermocouple_Amplifier3 (SB2_Thermocouple_Amplifier3.2), Thermocouples/Thermocouple_Amplifier4 (SB2_Thermocouple_Amplifier4.2), Pressure_Transducers (U3.23)
MOSI: RIO_MCU (U1.91), Pressure_Transducers (U3.24)
NetC10_2: RIO_MCU (U1.49), Power (C10.2)
NetC11_2: RIO_MCU (U1.73), Power (C11.2)
NetC12_2: RIO_MCU (U1.22), Power (C12.2 C13.2 FB1.1 R1.2)
NetC14_1: RIO_MCU (U1.21), Power (C14.1 C15.1 R1.1)
NetU1_77: RIO_MCU (U1.77), Flight_Computer (U2.17)
OSC_IN: RIO_MCU (U1.12), Power (R2#1.2)
OSC_OUT: RIO_MCU (U1.13), Power (C17.2 X1.2)
PT_CS: RIO_MCU (U1.85), Pressure_Transducers (U3.3)
Reset: RIO_MCU (U1.14), SWD_Breakout (B1.1 C36.2 R13.1)
SCK: RIO_MCU (U1.89), Thermocouples/Thermocouple_Amplifier1 (SB3_Thermocouple_Amplifier1.2), Thermocouples/Thermocouple_Amplifier2 (SB3_Thermocouple_Amplifier2.2), Thermocouples/Thermocouple_Amplifier3 (SB3_Thermocouple_Amplifier3.2), Thermocouples/Thermocouple_Amplifier4 (SB3_Thermocouple_Amplifier4.2), Pressure_Transducers (U3.1)
Slave_MISO: RIO_MCU (U1.79), Flight_Computer (U2.21)
Slave_MOSI: RIO_MCU (U1.80), Flight_Computer (U2.18)
Slave_SCK: RIO_MCU (U1.78), Flight_Computer (U2.22)
SOL: RIO_MCU (U1.58), Solenoids/Solenoid Driver5 (U7_SolenoidDriver5.4)
SOL: RIO_MCU (U1.59), Solenoids/Solenoid Driver4 (U7_SolenoidDriver4.4)
SOL: RIO_MCU (U1.60), Solenoids/Solenoid Driver3 (U7_SolenoidDriver3.4)
SOL: RIO_MCU (U1.61), Solenoids/Solenoid Driver2 (U7_SolenoidDriver2.4)
SOL: RIO_MCU (U1.62), Solenoids/Solenoid Driver1 (U7_SolenoidDriver1.4)
SOL_PWR1: Solenoids (J2#2.9), Solenoids/Solenoid Driver1 (D1_SolenoidDriver1.2 Q1_SolenoidDriver1.3)
SOL_PWR2: Solenoids (J2#2.7), Solenoids/Solenoid Driver2 (D1_SolenoidDriver2.2 Q1_SolenoidDriver2.3)
SOL_PWR3: Solenoids (J2#2.5), Solenoids/Solenoid Driver3 (D1_SolenoidDriver3.2 Q1_SolenoidDriver3.3)
SOL_PWR4: Solenoids (J2#2.3), Solenoids/Solenoid Driver4 (D1_SolenoidDriver4.2 Q1_SolenoidDriver4.3)
SOL_PWR5: Solenoids (J2#2.1), Solenoids/Solenoid Driver5 (D1_SolenoidDriver5.2 Q1_SolenoidDriver5.3)
SWCLK: RIO_MCU (U1.76), SWD_Breakout (J5.2)
SWDIO: RIO_MCU (U1.72), SWD_Breakout (J5.3)
T+: Thermocouples (J3#2.2), Thermocouples/Thermocouple_Amplifier1 (U5_Thermocouple_Amplifier1.3)
T+: Thermocouples (J3#2.4), Thermocouples/Thermocouple_Amplifier2 (U5_Thermocouple_Amplifier2.3)
T+: Thermocouples (J3#2.6), Thermocouples/Thermocouple_Amplifier3 (U5_Thermocouple_Amplifier3.3)
T+: Thermocouples (J3#2.8), Thermocouples/Thermocouple_Amplifier4 (U5_Thermocouple_Amplifier4.3)
T-: Thermocouples (J3#2.1), Thermocouples/Thermocouple_Amplifier1 (U5_Thermocouple_Amplifier1.2)
T-: Thermocouples (J3#2.3), Thermocouples/Thermocouple_Amplifier2 (U5_Thermocouple_Amplifier2.2)
T-: Thermocouples (J3#2.5), Thermocouples/Thermocouple_Amplifier3 (U5_Thermocouple_Amplifier3.2)
T-: Thermocouples (J3#2.7), Thermocouples/Thermocouple_Amplifier4 (U5_Thermocouple_Amplifier4.2)
UART_RX: RIO_MCU (U1.26), SWD_Breakout (J6.2)
UART_TX: RIO_MCU (U1.25), SWD_Breakout (J6.3)